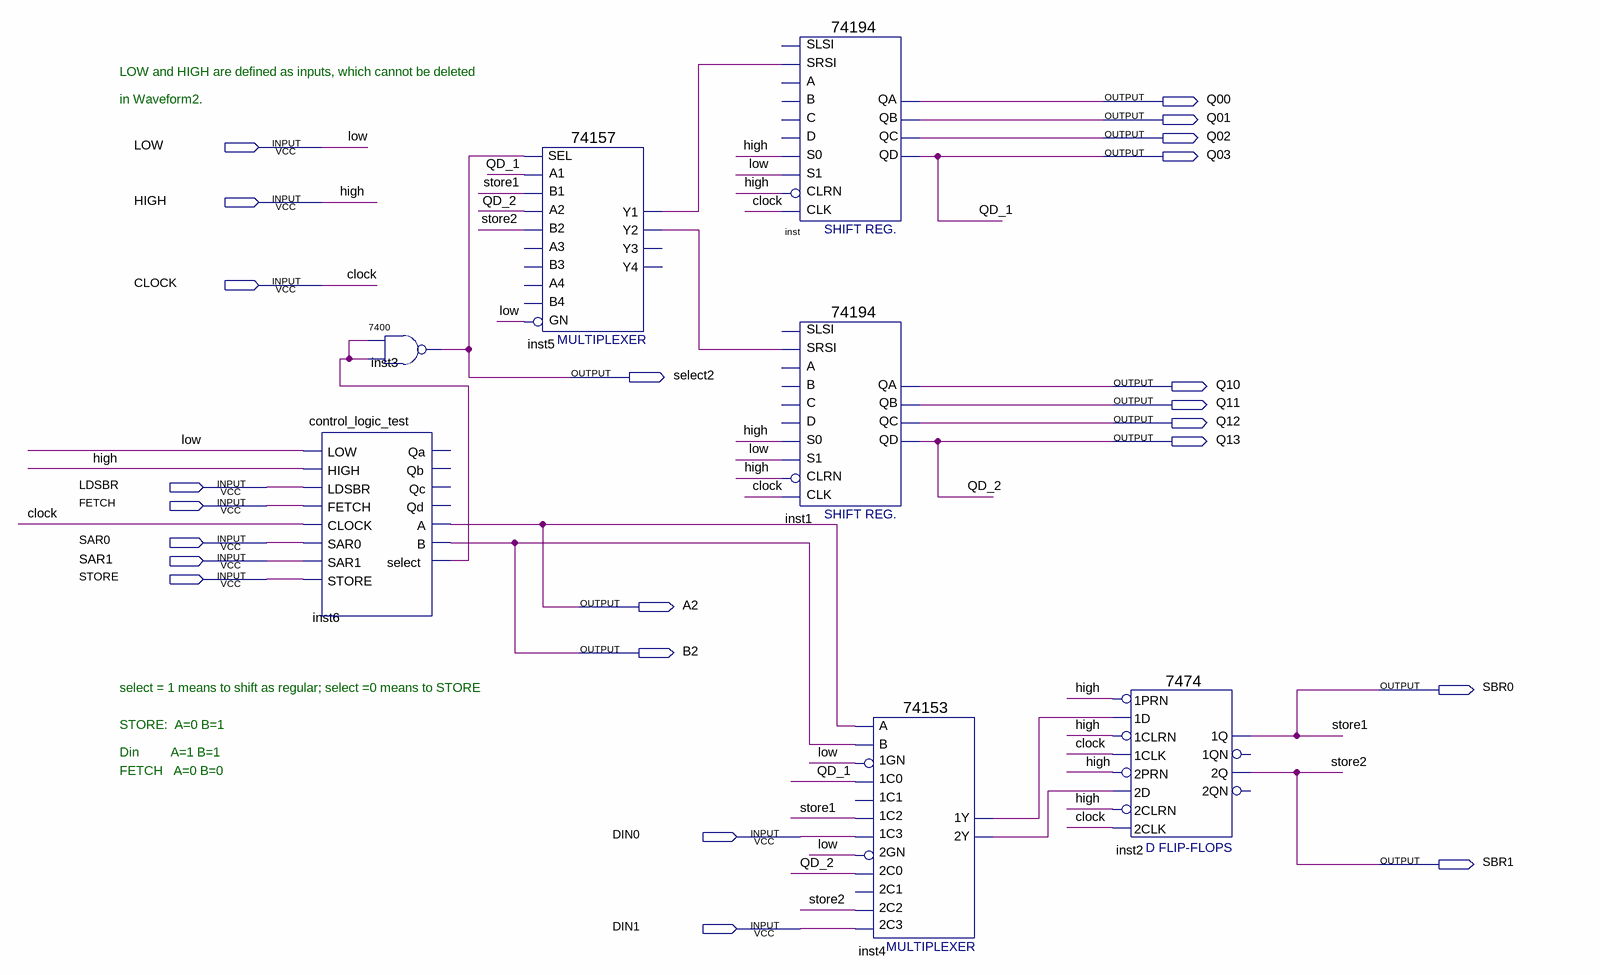
[diagram p0: schematic sheet]
// Quartus schematic Lab2.bdf as structural Verilog: 7 symbols, 23 pins
module Lab2 (
  input  LOW,
  input  HIGH,
  input  CLOCK,
  input  LDSBR,
  input  FETCH,
  input  SAR0,
  input  SAR1,
  input  STORE,
  input  DIN0,
  input  DIN1,
  output Q00,
  output Q01,
  output Q02,
  output Q03,
  output select2,
  output Q10,
  output Q11,
  output Q12,
  output Q13,
  output A2,
  output B2,
  output SBR0,
  output SBR1
);

  wire inst4_1y, inst4_2y, inst5_y1, inst5_y2, inst6_select;

  control_logic_test inst6 (
    .LOW(LOW), .HIGH(HIGH), .LDSBR(LDSBR), .FETCH(FETCH), .CLOCK(CLOCK), .SAR0(SAR0), .SAR1(SAR1),
    .STORE(STORE), .A(A2), .B(B2), .select(inst6_select));  // open: Qa, Qb, Qc, Qd
  \7400  inst3 (.\3 (inst6_select), .\2 (inst6_select), .\1 (select2));
  \74157  inst5 (
    .A1(Q03), .B1(SBR0), .SEL(select2), .B2(SBR1), .A2(Q13), .GN(LOW), .Y2(inst5_y2), .Y1(inst5_y1));  // open: A3, B3, B4, A4, Y4, Y3
  \74194  inst (
    .SRSI(inst5_y1), .CLK(CLOCK), .CLRN(HIGH), .S1(LOW), .S0(HIGH), .QA(Q00), .QB(Q01), .QC(Q02), .QD(Q03));  // open: SLSI, B, C, D, A
  \74194  inst1 (
    .SRSI(inst5_y2), .CLK(CLOCK), .CLRN(HIGH), .S1(LOW), .S0(HIGH), .QA(Q10), .QB(Q11), .QC(Q12), .QD(Q13));  // open: SLSI, B, C, D, A
  \74153  inst4 (
    .\1GN (LOW), .\1C0 (Q03), .\2C0 (Q13), .\2GN (LOW), .\2C2 (SBR1), .\1C2 (SBR0), .\1C3 (DIN0), .B(B2),
    .A(A2), .\2C3 (DIN1), .\1Y (inst4_1y), .\2Y (inst4_2y));  // open: 1C1, 2C1
  \7474  inst2 (
    .\2D (inst4_2y), .\2PRN (HIGH), .\1CLK (CLOCK), .\1D (inst4_1y), .\1PRN (HIGH), .\2CLK (CLOCK),
    .\2CLRN (HIGH), .\1CLRN (HIGH), .\2Q (SBR1), .\1Q (SBR0));  // open: 1QN, 2QN

  // Other names for the same wires on the sheet: QD_1 = Q03; QD_2 = Q13; store1 = SBR0; store2 = SBR1

  // Notes on the sheet:
  //   LOW and HIGH are defined as inputs, which cannot be deleted
  //   in Waveform2.
  //   select = 1 means to shift as regular; select =0 means to STORE
  //   STORE:  A=0 B=1 
  //   Din         A=1 B=1
  //   FETCH   A=0 B=0
endmodule
